# Altium schematic sheet ET-AIO.SchDoc: Eurocard VME 3U (3.937 x 6.299 inches)
size A4; Organization: Organization; Address1: Address1; Address2: Address2; Address3: Address3; Address4: Address4; DocumentNumber: 1; Revision: 0; SheetNumber: 2; SheetTotal: 2
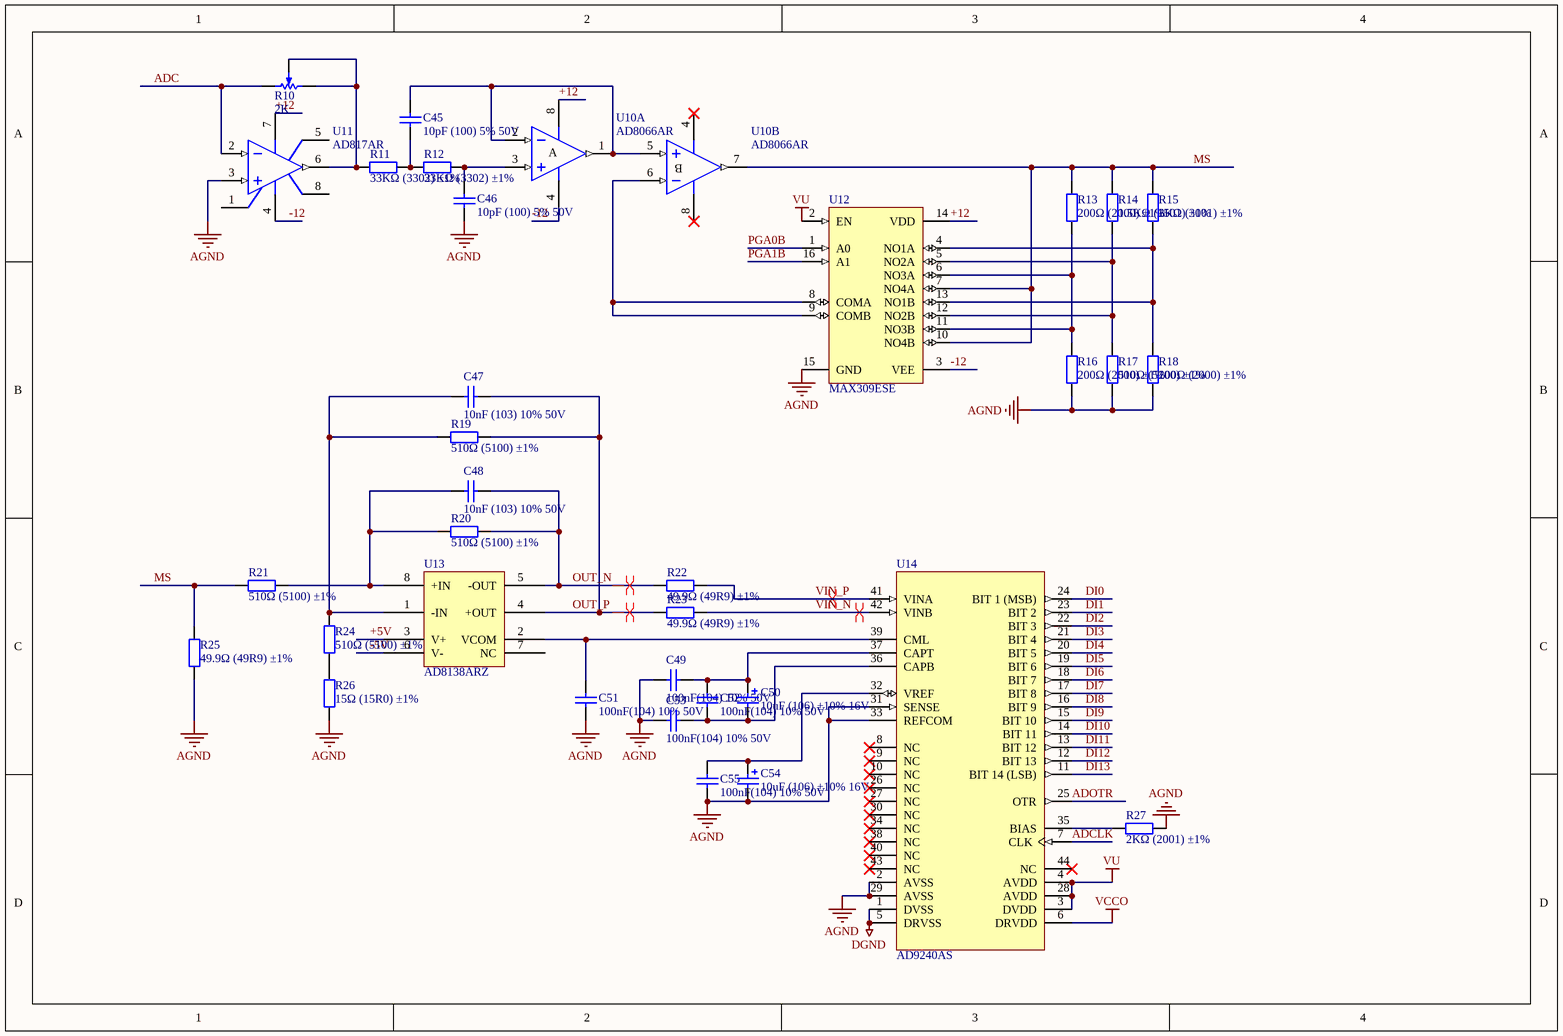
[diagram p0: ET-AIO.SchDoc]

## Parts
C45  10pF (100) 5% 50V  [LC-0805_C]
C46  10pF (100) 5% 50V  [LC-0805_C]
C47  10nF (103) 10% 50V  [LC-0805_C]
C48  10nF (103) 10% 50V  [LC-0805_C]
C49  100nF(104) 10% 50V  [LC-0805_C]
C50  10uF (106) ±10% 16V  [LC-CASE-A_3216]
C51  100nF(104) 10% 50V  [LC-0805_C]
C52  100nF(104) 10% 50V  [LC-0805_C]
C53  100nF(104) 10% 50V  [LC-0805_C]
C54  10uF (106) ±10% 16V  [LC-CASE-A_3216]
C55  100nF(104) 10% 50V  [LC-0805_C]
R10  2K  [POT4MM-2]
R11  33KΩ (3302) ±1%  [LC-0805_R]
R12  33KΩ (3302) ±1%  [LC-0805_R]
R13  200Ω (2000) ±1%  [LC-0805_R]
R14  1.5KΩ (1501) ±1%  [LC-0805_R]
R15  3KΩ (3001) ±1%  [LC-0805_R]
R16  200Ω (2000) ±1%  [LC-0805_R]
R17  510Ω (5100) ±1%  [LC-0805_R]
R18  200Ω (2000) ±1%  [LC-0805_R]
R19  510Ω (5100) ±1%  [LC-0805_R]
R20  510Ω (5100) ±1%  [LC-0805_R]
R21  510Ω (5100) ±1%  [LC-0805_R]
R22  49.9Ω (49R9) ±1%  [LC-0805_R]
R23  49.9Ω (49R9) ±1%  [LC-0805_R]
R24  510Ω (5100) ±1%  [LC-0805_R]
R25  49.9Ω (49R9) ±1%  [LC-0805_R]
R26  15Ω (15R0) ±1%  [LC-0805_R]
R27  2KΩ (2001) ±1%  [LC-0805_R]
U10  AD8066AR  [SO-8_N]  (parts A,B of 2)
U11  AD817AR  [SO-8_N]
U12  MAX309ESE  [NSO16_N]
U13  AD8138ARZ  [SO-8_N]
U14  AD9240AS  [S-44-MQFP_N]

## Nets
AGND: C46.1 C49.2 C51.1 C53.2 C54.2 C55.1 R16.1 R17.1 R18.1 R25.1 R26.1 R27.2 U11.3(IN+) U12.15(GND) U14.2(AVSS) U14.29(AVSS) U14.31(SENSE) U14.33(REFCOM)
DGND: U14.1(DVSS) U14.5(DRVSS)
VCCO: U14.6(DRVDD)
VU: U12.2(EN) U14.3(DVDD) U14.4(AVDD) U14.28(AVDD)
+5V: U13.3(V+)
+12: U10.8(V+) U11.7(V+) U12.14(VDD)
-5V: U13.6(V-)
-12: U10.4(V-) U11.4(V-) U12.3(VEE)
ADC: R10.CW(+) U11.2(IN-)
ADCLK: U14.7(CLK)
ADOTR: U14.25(OTR)
DI0: U14.24(BIT_1_(MSB))
DI1: U14.23(BIT_2)
DI2: U14.22(BIT_3)
DI3: U14.21(BIT_4)
DI4: U14.20(BIT_5)
DI5: U14.19(BIT_6)
DI6: U14.18(BIT_7)
DI7: U14.17(BIT_8)
DI8: U14.16(BIT_9)
DI9: U14.15(BIT_10)
DI10: U14.14(BIT_11)
DI11: U14.13(BIT_12)
DI12: U14.12(BIT_13)
DI13: U14.11(BIT_14_(LSB))
MS: R13.2 R14.2 R15.2 R21.1 R25.2 U10.7(OUT) U12.7(NO4A) U12.10(NO4B)
OUT_N: C48.2 R20.2 R22.1 U13.5(-OUT)
OUT_P: C47.2 R19.2 R23.1 U13.4(+OUT)
PGA0B: U12.1(A0)
PGA1B: U12.16(A1)
VIN_N: R23.2 U14.42(VINB)
VIN_P: R22.2 U14.41(VINA)
NetC45_1: C45.1 R11.2 R12.1
NetC45_2: C45.2 U10.1(OUT) U10.2(IN-) U10.5(IN+)
NetC46_2: C46.2 R12.2 U10.3(IN+)
NetC47_1: C47.1 R19.1 R24.2 U13.1(-IN)
NetC48_1: C48.1 R20.1 R21.2 U13.8(+IN)
NetC49_1: C49.1 C50.1 C52.2 U14.37(CAPT)
NetC50_2: C50.2 C52.1 C53.1 U14.36(CAPB)
NetC51_2: C51.2 U13.2(VCOM) U14.39(CML)
NetC54_1: C54.1 C55.2 U14.32(VREF)
NetR10_CCW: R10.CCW(-) R10.W R11.1 U11.6(OUT)
NetR13_1: R13.1 R16.2 U12.6(NO3A) U12.11(NO3B)
NetR14_1: R14.1 R17.2 U12.5(NO2A) U12.12(NO2B)
NetR15_1: R15.1 R18.2 U12.4(NO1A) U12.13(NO1B)
NetR24_1: R24.1 R26.2
NetR27_1: R27.1 U14.35(BIAS)
NetU10_6: U10.6(IN-) U12.8(COMA) U12.9(COMB)

Not connected (* = marked no-connect by the designer): U11 1(NULL1) 5(NC) 8(NULL2); U13 7(NC); U14 8(NC)* 9(NC)* 10(NC)* 26(NC)* 27(NC)* 30(NC)* 34(NC)* 38(NC)* 40(NC)* 43(NC)* 44(NC)*

## Layout directives
differential pair: OUT_N, OUT_P, VIN_N, VIN_P

## Notes on the sheet
- (in symbol AD8056AR, part A) A
- (in symbol AD8056AR, part B) B

## Library data of the parts
C45 C46 = 0805 10pF (100) 5% 50V: 贴片电容; ComponentLink1Description: 供应商链接; ComponentLink1URL: http://www.szlcsc.com/product/details_2137.html; Package: 0805; Supplier: LC; SuppliersPartNumber: C1785
C47 C48 = 0805 10nF (103) 10% 50V: 贴片电容; ComponentLink1Description: 供应商链接; ComponentLink1URL: http://www.szlcsc.com/product/details_2062.html; Package: 0805; Supplier: LC; SuppliersPartNumber: C1710
C49 C51-C53 C55 = 0805 100nF(104) 10% 50V: 贴片电容; ComponentLink1Description: 供应商链接; ComponentLink1URL: http://www.szlcsc.com/product/details_50686.html; Package: 0805; Supplier: LC; SuppliersPartNumber: C49678
C50 C54 = 3216 10uF (106) 10% 16V: 钽电容; ComponentLink1Description: 供应商链接; ComponentLink1URL: http://www.szlcsc.com/product/details_7643.html; Package: 3216; Supplier: LC; SuppliersPartNumber: C7171
R10 = RPot SM: Square Trimming Potentiometer; Published: 17-Dec-2003; DatasheetVersion: Oct-2003; PackageReference: POT4MM-2; Publisher: Altium Limited; PackageDescription: Square Trimming Potentiometer; ComponentLink1Description: Manufacturer Link; ComponentLink1URL: http://bourns.com/2/search.html
R11 R12 = 0805 33KΩ (3302) 1%: 贴片电阻; ComponentLink1Description: 供应商链接; ComponentLink1URL: http://www.szlcsc.com/product/details_18321.html; Package: 0805; Supplier: LC; SuppliersPartNumber: C17633
R13 R16 R18 = 0805 200Ω (2000) 1%: 贴片电阻; ComponentLink1Description: 供应商链接; ComponentLink1URL: http://www.szlcsc.com/product/details_18228.html; Package: 0805; Supplier: LC; SuppliersPartNumber: C17540
R14 = 0805 1.5KΩ (1501) 1%: 贴片电阻; ComponentLink1Description: 供应商链接; ComponentLink1URL: http://www.szlcsc.com/product/details_4717.html; Package: 0805; Supplier: LC; SuppliersPartNumber: C4310
R15 = 0805 3KΩ (3001) 1%: 贴片电阻; ComponentLink1Description: 供应商链接; ComponentLink1URL: http://www.szlcsc.com/product/details_18349.html; Package: 0805; Supplier: LC; SuppliersPartNumber: C17661
R17 R19-R21 R24 = 0805 510Ω (5100) 1%: 贴片电阻; ComponentLink1Description: 供应商链接; ComponentLink1URL: http://www.szlcsc.com/product/details_18422.html; Package: 0805; Supplier: LC; SuppliersPartNumber: C17734
R22 R23 R25 = 0805 49.9Ω (49R9) 1%: 贴片电阻; ComponentLink1Description: 供应商链接; ComponentLink1URL: http://www.szlcsc.com/product/details_18408.html; Package: 0805; Supplier: LC; SuppliersPartNumber: C17720
R26 = 0805 15Ω (15R0) 1%: 贴片电阻; ComponentLink1Description: 供应商链接; ComponentLink1URL: http://www.szlcsc.com/product/details_18168.html; Package: 0805; Supplier: LC; SuppliersPartNumber: C17480
R27 = 0805 2KΩ (2001) 1%: 贴片电阻; ComponentLink1Description: 供应商链接; ComponentLink1URL: http://www.szlcsc.com/product/details_18292.html; Package: 0805; Supplier: LC; SuppliersPartNumber: C17604
U10 = AD8056AR: Low Cost, 300MHz Voltage Feedback Amplifier; Published: 8-Jun-2000; LatestRevisionDate: 13-Apr-2006; LatestRevisionNote: IPC-7351 Footprint Added.; DatasheetVersion: REV. 0 1997; PackageVersion: revA; PackageReference: SO-8; Publisher: Altium Limited; PackageDescription: 8-Pin Small Outline Integrated Circuit 1.27 mm Pitch; Code_JEDEC: MS-012-AA; Code_IPC: SOIC127P600-8; ComponentLink1Description: Manufacturer Link; ComponentLink1URL: http://www.analog.com/en/prod/0,,759_786_AD8055%2C00.html; ComponentLink2Description: Datasheet; ComponentLink2URL: http://www.analog.com/UploadedFiles/Data_Sheets/40402558757264AD8055_6_i.pdf
U11 = AD817AR: High-Speed, Low-Power Wide Supply Range Amplifier; Note: Pin 5 is not connected.; Published: 8-Jun-2000; LatestRevisionDate: 13-Apr-2006; LatestRevisionNote: IPC-7351 Footprint Added.; DatasheetVersion: REV. B 1995; PackageVersion: revA; PackageReference: SO-8; Publisher: Altium Limited; PackageDescription: 8-Pin Small Outline Integrated Circuit 1.27 mm Pitch; Code_JEDEC: MS-012-AA; Code_IPC: SOIC127P600-8; ComponentLink1Description: Manufacturer Link; ComponentLink1URL: http://www.analog.com/en/prod/0,,759_786_AD817%2C00.html; ComponentLink2Description: Datasheet; ComponentLink2URL: http://www.analog.com/UploadedFiles/Data_Sheets/289066266ad817.pdf
U12 = MAX309ESE: Precision, Dual 4-Channel, High-Performance, CMOS Analog Multiplexer; Published: 16-Jan-2001; LatestRevisionDate: 13-Apr-2006; LatestRevisionNote: IPC-7351 Footprint Added.; DatasheetVersion: Jul-1994; PackageReference: NSO16; Publisher: Altium Limited; PackageDescription: 16-Pin Small Outline Integrated Circuit 1.27 mm Pitch; Code_JEDEC: MS-012-AC; Code_IPC: SOIC127P600-16; ComponentLink1Description: Manufacturer Link; ComponentLink1URL: http://www.maxim-ic.com/; ComponentLink2Description: Datasheet; ComponentLink2URL: http://pdfserv.maxim-ic.com/en/ds/MAX308-MAX309.pdf
U14 = AD9240AS: Complete 14-Bit, 10 MSPS Monolithic A/D Converter, 44-Pin MQFP, Industrial; Published: 26-May-2004; LatestRevisionDate: 13-Apr-2006; LatestRevisionNote: IPC-7351 Footprint Added.; DatasheetVersion: Rev. A; PackageVersion: Rev. A; PackageReference: S-44-MQFP; Publisher: Altium Limited; PackageDescription: 44-Pin Metric Quad Flat Pack 0.8 mm Pitch; Code_IPC: QFP80P1320X1320-44; ComponentLink1Description: Manufacturer Link; ComponentLink1URL: http://www.analog.com/en/prod/0%2C2877%2CAD9240%2C00.html; ComponentLink2Description: Datasheet; ComponentLink2URL: http://www.analog.com/UploadedFiles/Data_Sheets/417954540AD9240_a.pdf